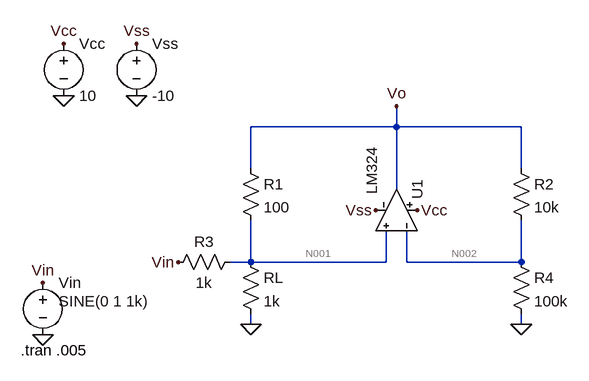
[diagram p0: schematic Circuito2.asc]
Circuito2.asc, the LTspice schematic file:
Version 4
SHEET 1 880 680
WIRE 176 -80 176 -112
WIRE 176 -80 -48 -80
WIRE 368 -80 176 -80
WIRE -48 -16 -48 -80
WIRE 368 -16 368 -80
WIRE 176 16 176 -80
WIRE -48 128 -48 64
WIRE -48 128 -80 128
WIRE 160 128 160 80
WIRE 160 128 -48 128
WIRE 192 128 192 80
WIRE 368 128 368 64
WIRE 368 128 192 128
WIRE -48 224 -48 208
WIRE 368 224 368 208
FLAG -48 224 0
FLAG 368 224 0
FLAG 176 -112 Vo
FLAG -336 -208 Vcc
FLAG 208 48 Vcc
FLAG -224 -208 Vss
FLAG 144 48 Vss
FLAG -224 -128 0
FLAG -336 -128 0
FLAG -368 240 0
FLAG -368 160 Vin
FLAG -160 128 Vin
SYMBOL AutoGenerated\\LM324 176 48 M270
WINDOW 3 61 22 Top 2
SYMATTR InstName U1
SYMBOL res -64 -32 R0
SYMATTR InstName R1
SYMATTR Value 100
SYMBOL res 352 -32 R0
SYMATTR InstName R2
SYMATTR Value 10k
SYMBOL res -64 112 R90
WINDOW 0 0 56 VBottom 2
WINDOW 3 32 56 VTop 2
SYMATTR InstName R3
SYMATTR Value 1k
SYMBOL res 352 112 R0
SYMATTR InstName R4
SYMATTR Value 100k
SYMBOL res -64 112 R0
SYMATTR InstName RL
SYMATTR Value 1k
SYMBOL voltage -368 144 R0
WINDOW 3 24 44 Left 2
WINDOW 123 24 72 Left 2
WINDOW 39 0 0 Left 0
SYMATTR Value SINE(0 1 1k)
SYMATTR InstName Vin
SYMBOL voltage -336 -224 R0
WINDOW 123 0 0 Left 0
WINDOW 39 0 0 Left 0
SYMATTR InstName Vcc
SYMATTR Value 10
SYMBOL voltage -224 -224 R0
SYMATTR InstName Vss
SYMATTR Value -10
TEXT -402 264 Left 2 !.tran .005

The netlist it stands for:
* Circuito2.asc
XU1 N001 N002 Vcc Vss Vo LM324  ; pins In+ In- V+ V- OUT
R1 Vo N001 100
R2 Vo N002 10k
R3 N001 Vin 1k
R4 N002 0 100k
RL N001 0 1k
Vin Vin 0 SINE(0 1 1k)
Vcc Vcc 0 10
Vss Vss 0 -10
.tran .005
.lib E:\LtSpice_components\LM324.ti.lib
.backanno
.end

* Results of the author's LTspice run, read from the files saved beside the schematic
* Operating Point, zero values left out:
*   V(vo) = -2.813 mV
*   V(vss) = -10 V
*   V(vcc) = 10 V
*   V(n002) = -2.376 mV
*   V(n001) = -2.342 mV
*   I(R1) = -4.705 µA
*   I(R2) = -43.7 nA
*   I(R3) = -2.342 µA
*   I(R4) = -23.76 nA
*   I(Rl) = -2.342 µA
*   I(Vin) = -2.342 µA
*   I(Vcc) = -669.9 µA
*   I(Vss) = 669.8 µA
*   Ix(u1:1) = -19.92 nA
*   Ix(u1:2) = -19.94 nA
*   Ix(u1:3) = 669.9 µA
*   Ix(u1:4) = -669.8 µA
*   Ix(u1:5) = 4.748 µA
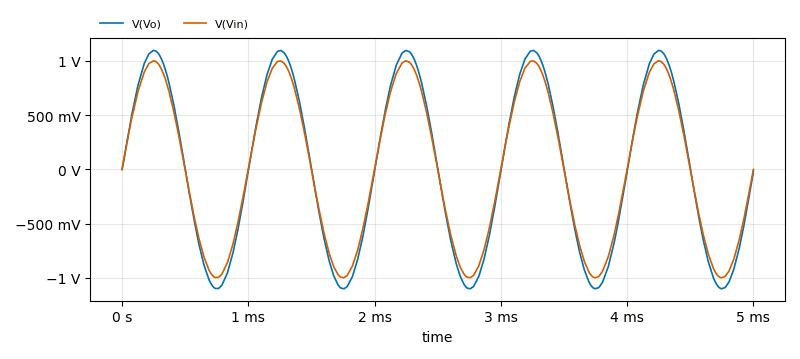
[diagram p1: Transient Analysis of Circuito2.asc, plotted from the saved traces]
* Transient Analysis, 1 run:
*   V(Vo): min -1.101 V, max 1.096 V, average -2.729 mV, rms 776.9 mV, last -18.03 mV
*   V(Vin): min -999.8 mV, max 1 V, average 66.42 µV, rms 707 mV, last 0 V